# Altium schematic sheet ISO_COMMS.SchDoc
size A4; SheetNumber: 6; SheetTotal: 6
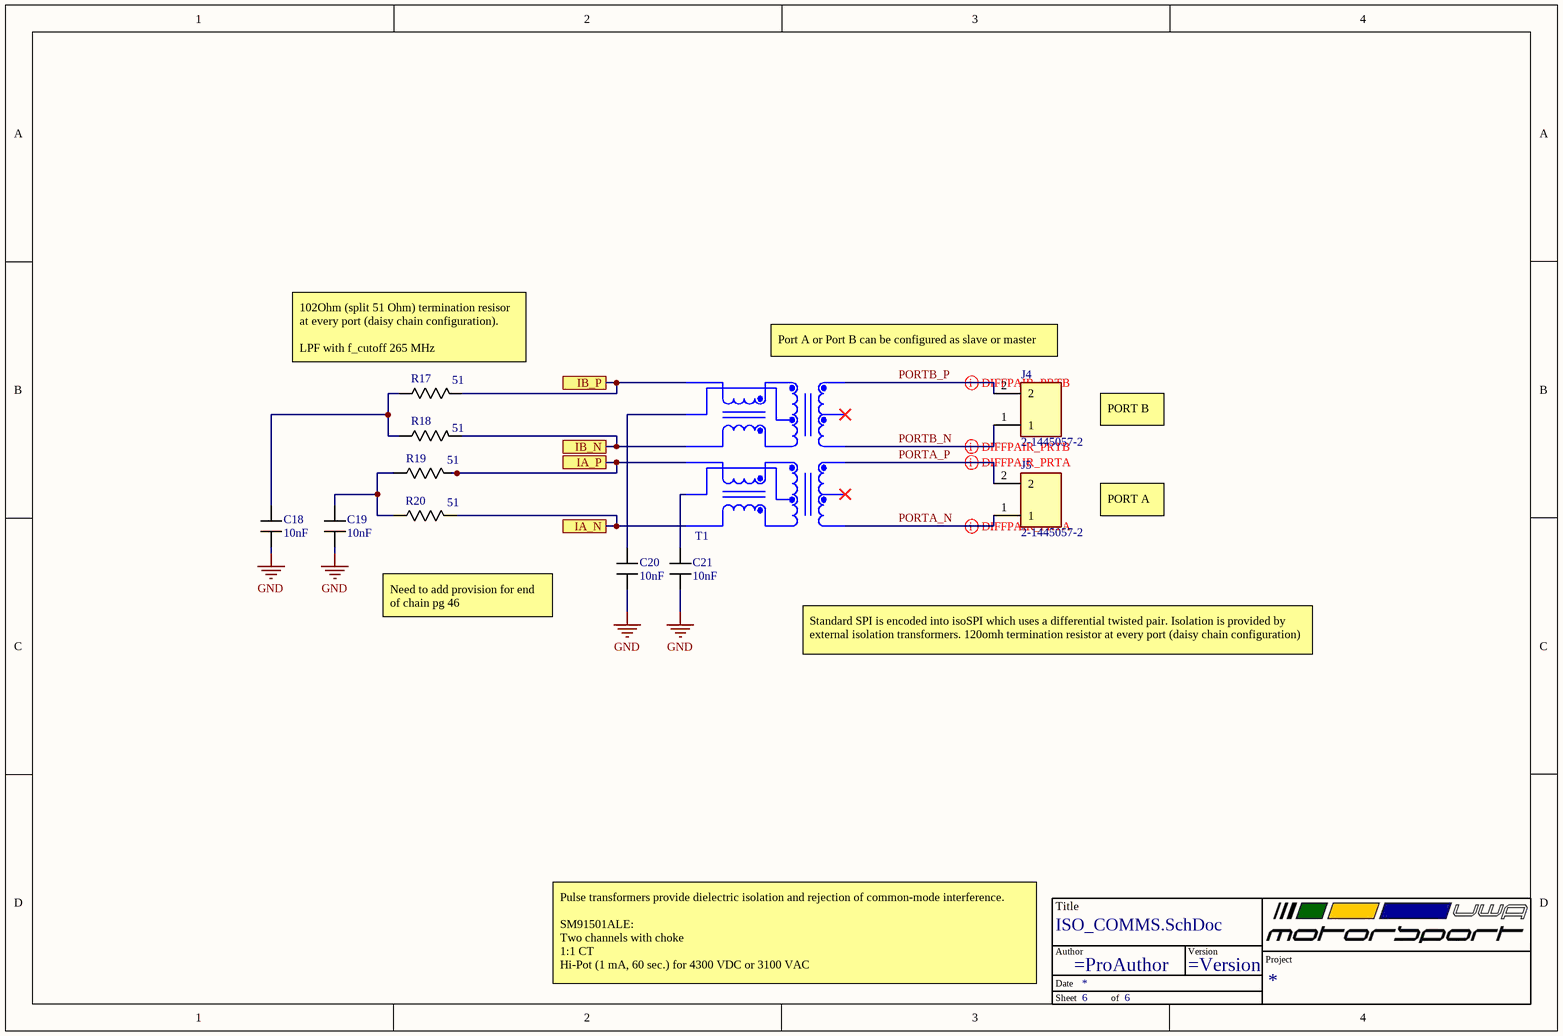
[diagram p0: ISO_COMMS.SchDoc]

## Parts
*  TitleBlock  (value not drawn)  (graphical)
C18  value 10nF  [C_0603]  (hidden comment: C)
C19  value 10nF  [C_0603]  (hidden comment: C)
C20  value 10nF  [C_0603]  (hidden comment: C)
C21  value 10nF  [C_0603]  (hidden comment: C)
J4  2-1445057-2  [TE_2-1445057-2]
J5  2-1445057-2  [TE_2-1445057-2]
R17  value 51  [R-0603]  (hidden comment: Resistor)
R18  value 51  [R-0603]  (hidden comment: Resistor)
R19  value 51  [R-0603]  (hidden comment: Resistor)
R20  value 51  [R-0603]  (hidden comment: Resistor)
T1  SM91501ALE  [SM91501ALE]  (value not drawn)

## Ports
IA_N, IA_P, IB_N, IB_P

## Nets
GND: C18.1 C19.1 C20.2 C21.1
IA_N: R20.1 T1.7 ; port IA_N
IA_P: R19.2 T1.9 ; port IA_P
IB_N: R18.1 T1.10 ; port IB_N
IB_P: R17.2 T1.12 ; port IB_P
PORTA_N: J5.1 T1.6
PORTA_P: J5.2 T1.4
PORTB_N: J4.1 T1.3
PORTB_P: J4.2 T1.1
NetC18_2: C18.2 R17.1 R18.2
NetC19_2: C19.2 R19.1 R20.2
NetC20_1: C20.1 T1.11
NetC21_2: C21.2 T1.8

Not connected (* = marked no-connect by the designer): T1 2* 5*

## Layout directives
differential pair; differential pair class PRTB: PORTB_N, PORTB_P
differential pair; differential pair class PRTA: PORTA_N, PORTA_P

## Notes on the sheet
- (near R17) 102Ohm (split 51 Ohm) termination resisor at every port (daisy chain configuration).
  LPF with f_cutoff 265 MHz
- Port A or Port B can be configured as slave or master
- PORT B
- PORT A
- Need to add provision for end of chain pg 46
- Standard SPI is encoded into isoSPI which uses a differential twisted pair. Isolation is provided by external isolation transformers. 120omh termination resistor at every port (daisy chain configuration)
- (near *) Pulse transformers provide dielectric isolation and rejection of common-mode interference.
  SM91501ALE:
  Two channels with choke
  1:1 CT
  Hi-Pot (1 mA, 60 sec.) for 4300 VDC or 3100 VAC
- (in symbol TitleBlock) Title; Author; Version; Project; Date; Sheet; of

## Library data of the parts
C18-C21 = Capacitor: ComponentLink1Description: New link; ComponentLink1URL: *
J4 = 2-1445057-2: CONN HEADER 3MM 2POS R/A TIN SMD--; MF: {'manufacturer': u'TE Connectivity'}; Package: None; MP: 2-1445057-2; Availability: Unavailable; Price: None; Value: *
J5 = 2-1445057-2: CONN HEADER 3MM 2POS R/A TIN SMD; MF: {'manufacturer': u'TE Connectivity'}; Package: None; MP: 2-1445057-2; Availability: Unavailable; Price: None; Value: *
T1 = SM91501ALE: BMS XFORMER 2-CH 1600V AECQ +125; Manufacturer: Bourns; Inductance: 150uH; Turns Ratio: 1:1; Supplier 1: Mouser; Manufacturer Part Number: SM91501ALE; RoHS: No; Stock 1: 566; Pricing 1: 1=5.20000, 10=4.21000, 50=3.14000, 100=3.05000, 1000=2.78000, 10000=2.78000 (USD); Mount: Surface Mount; Min Operating Temperature: -40°C; Max Operating Temperature: 125°C; Packaging: Cut Tape; ComponentLink1URL: https://www.bourns.com/docs/product-datasheets/sm91501al.pdf?src-supplier=Digi-Key; ComponentLink1Description: https://www.bourns.com/docs/product-datasheets/sm91501al.pdf?src-supplier=Digi-Key; Supplier Part Number 1: 652-SM91501ALE